# Altium schematic sheet Main.SchDoc: Main sheet
size A4; DrawnBy: Jelle De Vleeschouwer; ProjectName: Wakelet
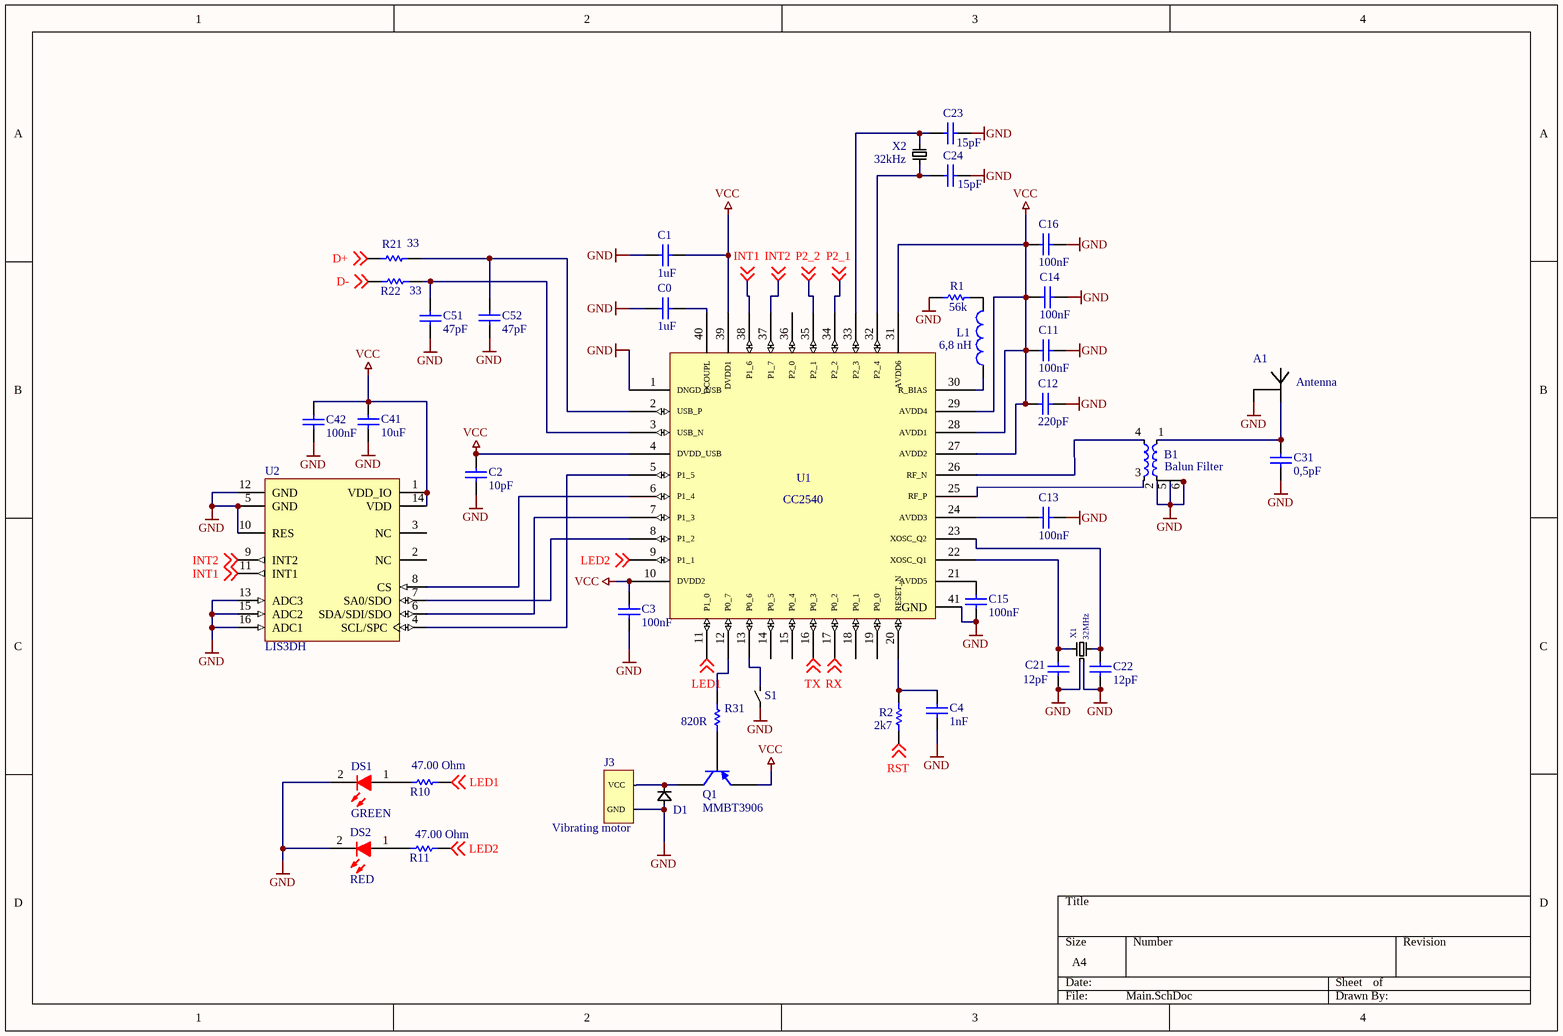
[diagram p0: Main.SchDoc]

## Parts
A1  Antenna  [Antenna]  (net tie, no BOM)
B1  Balun Filter  [Balun Filter]
C0  1uF  [CAPC0402(1005)60_L]
C1  1uF  [CAPC0402(1005)60_L]
C2  10pF  [CAPC0402(1005)60_L]
C3  100nF  [CAPC0402(1005)60_L]
C4  1nF  [CAPC0402(1005)60_L]
C11  100nF  [CAPC0402(1005)60_L]
C12  220pF  [CAPC0402(1005)60_L]
C13  100nF  [CAPC0402(1005)60_L]
C14  100nF  [CAPC0402(1005)60_L]
C15  100nF  [CAPC0402(1005)60_L]
C16  100nF  [CAPC0402(1005)60_L]
C21  12pF  [CAPC0402(1005)60_L]
C22  12pF  [CAPC0402(1005)60_L]
C23  15pF  [CAPC0402(1005)60_L]
C24  15pF  [CAPC0402(1005)60_L]
C31  0,5pF  [CAPC0402(1005)60_L]
C41  10uF  [CAPC0402(1005)60_L]
C42  100nF  [CAPC0402(1005)60_L]
C51  47pF  [CAPC0402(1005)60_L]
C52  47pF  [CAPC0402(1005)60_L]
D1  Diode  [Diode]  (value not drawn)
DS1  GREEN  [TOSH-0603LED_RED_V]
DS2  RED  [TOSH-0603LED_RED_V]
J3  Vibrating motor
L1  6,8 nH  [TAYO-INDC1005-2_V]
Q1  MMBT3906  [SOT-23A_L]
R1  56k  [RESC0402(1005)_N]
R2  2k7  [RESC0402(1005)_M]
R10  47.00 Ohm  [RESC0402(1005)_N]
R11  47.00 Ohm  [RESC0402(1005)_N]
R21  33  [RESC0402(1005)_M]
R22  33  [RESC0402(1005)_M]
R31  820R  [RESC0402(1005)_N]
S1  Switch  [Switch]  (value not drawn)
U1  CC2540  [QFN50P600X600X100_HS-41N_LATEST]
U2  LIS3DH  [STM-LGA-16_N]
X1  32MHz  [XTAL]
X2  32kHz  [XTAL 2]

## Nets
GND: A1.2 B1.2(PINLENGTH=1) B1.5(PINLENGTH=1) B1.6(PINLENGTH=1) C0.2 C1.1 C2.2 C3.2 C4.2 C11.1 C12.1 C13.1 C14.1 C15.2 C16.1 C21.2 C22.2 C23.1 C24.1 C31.2 C41.2 C42.2 C51.2 C52.1 D1.A DS1.2(K) DS2.2(K) J3.1(GND) R1.1 S1.1 U1.1(DNGD_USB) U1.41(GND) U2.5(GND) U2.10(RES) U2.12(GND) U2.13(ADC3) U2.15(ADC2) U2.16(ADC1) X1.2 X1.4
VCC: C1.2 C2.1 C3.1 C11.2 C12.2 C14.2 C16.2 C41.1 C42.1 Q1.2(E) U1.4(DVDD_USB) U1.10(DVDD2) U1.27(AVDD2) U1.28(AVDD1) U1.29(AVDD4) U1.31(AVDD6) U1.39(DVDD1) U2.1(VDD_IO) U2.14(VDD)
D+: R21.1 ; off-sheet D+
D-: R22.1 ; off-sheet D-
INT1: U1.38(P1_6) U2.11(INT1) ; off-sheet INT1
INT2: U1.37(P1_7) U2.9(INT2) ; off-sheet INT2
LED1: R10.2 U1.11(P1_0) ; off-sheet LED1
LED2: R11.2 U1.9(P1_1) ; off-sheet LED2
P2_1: U1.34(P2_2) ; off-sheet P2_1
P2_2: U1.35(P2_1) ; off-sheet P2_2
RST: R2.1 ; off-sheet RST
RX: U1.17(P0_2) ; off-sheet RX
TX: U1.16(P0_3) ; off-sheet TX
NetA1_1: A1.1 B1.1(PINLENGTH=1) C31.1
NetB1_3: B1.3(PINLENGTH=1) U1.25(RF_P)
NetB1_4: B1.4(PINLENGTH=1) U1.26(RF_N)
NetC0_1: C0.1 U1.40(DCOUPL)
NetC4_1: C4.1 R2.2 U1.20(RESET_N)
NetC13_2: C13.2 U1.24(AVDD3)
NetC15_1: C15.1 U1.21(AVDD5)
NetC21_1: C21.1 U1.22(XOSC_Q1) X1.1
NetC22_1: C22.1 U1.23(XOSC_Q2) X1.3
NetC23_2: C23.2 U1.33(P2_3) X2.1
NetC24_2: C24.2 U1.32(P2_4) X2.2
NetC51_1: C51.1 R22.2 U1.3(USB_N)
NetC52_2: C52.2 R21.2 U1.2(USB_P)
NetD1_K: D1.K J3.0(VCC) Q1.3(C)
NetDS1_1: DS1.1(A) R10.1
NetDS2_1: DS2.1(A) R11.1
NetL1_1: L1.1 U1.30(R_BIAS)
NetL1_2: L1.2 R1.2
NetQ1_1: Q1.1(B) R31.2
NetR31_1: R31.1 U1.12(P0_7)
NetS1_2: S1.2 U1.13(P0_6)
NetU1_5: U1.5(P1_5) U2.4(SCL/SPC)
NetU1_6: U1.6(P1_4) U2.8(CS)
NetU1_7: U1.7(P1_3) U2.6(SDA/SDI/SDO)
NetU1_8: U1.8(P1_2) U2.7(SA0/SDO)

Not connected (* = marked no-connect by the designer): U1 14(P0_5) 15(P0_4) 18(P0_1) 19(P0_0) 36(P2_0); U2 2(NC) 3(NC)

## Library data of the parts
B1 = 2450BM15A0002E: BALUN FILTER, 2.45GHZ
C0-C4 C11-C16 C21-C24 C31 C41 C42 C51 C52 = CMP-1034-00698-1: CAP 10pF 10V ±0.25pF 0402 (1005 Metric) Thickness 0.6mm SMD; Case-Metric: 1005; Case-EIA: 0402; Rated Voltage: 10 V; Max Thickness: 0.6 mm; Tolerance: ±0.25pF; Technology: SMT
  C0 C1: Value: 1uF
  C2: Value: 10pF
  C3 C11 C13-C16 C42: Value: 100nF
  C4: Value: 1nF
  C12: Value: 220pF
  C21 C22: Value: 12pF
  C23 C24: Value: 15pF
  C31: Value: 0,5pF
  C41: Value: 10uF
  C51 C52: Value: 47pF
DS1 = CMP-0444-00001-1: LTST-C191KGKT; Manufacturer: Toshiba; PartNumber: TLSU1008A(T04); Forward Current: 25 mA; Power Dissipation: 60 mW; Packing Type: Reel; Reverse Voltage: 4 V; Mounting Technology: Surface Mount; PackageDescription: 2-Pin SMT LED, 1.6 x 0.8 mm Pitch; ComponentLink1URL: http://www.toshiba-components.com/; ComponentLink1Description: Manufacturer URL; PackageReference: 0603LED_RED; ComponentLink2URL: http://www.semicon.toshiba.co.jp/info/docget.jsp?type=datasheet&lang=en&pid=TLSU1008A(T04); ComponentLink2Description: Datasheet; DatasheetVersion: Aug-08; Storage Temperature: -40 to 100 degC
DS2 = CMP-0444-00001-1: LTST-C191KRKT; Manufacturer: Toshiba; PartNumber: TLSU1008A(T04); Forward Current: 25 mA; Power Dissipation: 60 mW; Packing Type: Reel; Reverse Voltage: 4 V; Mounting Technology: Surface Mount; PackageDescription: 2-Pin SMT LED, 1.6 x 0.8 mm Pitch; ComponentLink1URL: http://www.toshiba-components.com/; ComponentLink1Description: Manufacturer URL; PackageReference: 0603LED_RED; ComponentLink2URL: http://www.semicon.toshiba.co.jp/info/docget.jsp?type=datasheet&lang=en&pid=TLSU1008A(T04); ComponentLink2Description: Datasheet; DatasheetVersion: Aug-08; Storage Temperature: -40 to 100 degC
J3 = MISCELLANEOUS CON
L1 = CMP-0436-00001-1: Inductor, Ferrite Bead 1K Ohm@100MHz 300mA 0402; PartNumber: BK1005HS102-T; Manufacturer: Taiyo Yuden; DC Resistance: 0.58 Ohm; Impedance: 1000 Ohm @ 100MHz; PackageDescription: 2-Pin Inductor, 1x0.5mm Body; Mounting Technology: Surface Mount; Rated Current: 300 mA; ComponentLink2URL: http://www.yuden.co.jp/ut/product/category/emisuppression/BK1005HS102-T.pdf; ComponentLink1URL: http://www.yuden.co.jp; DatasheetVersion: Jul-13; ComponentLink1Description: Manufacturer URL; ComponentLink2Description: Datasheet; PackageReference: INDC1005
Q1 = BC807-25: PNP General Purpose Amplifier; Published: 8-Jun-2000; LatestRevisionDate: 20-Nov-2009; LatestRevisionNote: IPC-7351 Footprint Added.; DatasheetVersion: 1997; PackageVersion: Sep-1998; PackageReference: SOT-23A; Publisher: Altium Limited; PackageDescription: 3-Pin SOT-23 Package 0.95 mm Pitch, 2.3 mm Lead Span; ComponentLink1Description: Manufacturer Link; ComponentLink1URL: http://www.fairchildsemi.com/; ComponentLink2Description: Datasheet; ComponentLink2URL: http://www.fairchildsemi.com/ds/BC%2FBC807.pdf
R1 = CMP-1011-00116-1: 56K 0.063W 5% 0402 (1005 Metric)  SMD; Case-EIA: 0402; Case-Metric: 1005; Technology: SMT; Value: 56k; Tolerance: 5 %; Power: 0.063 W
R2 = CMP-1011-00084-1: 2K7 0.063W 5% 0402 (1005 Metric)  SMD; Case-EIA: 0402; Case-Metric: 1005; Value: 2k7; Technology: SMT; Tolerance: 5 %; Power: 0.063 W
R10 R11 = CMP-1011-00042-1: 47R 0.063W 5% 0402 (1005 Metric)  SMD; Case-Metric: 1005; Case-EIA: 0402; Tolerance: 5 %; Power: 0.063 W; Technology: SMT; Value: 47.00 Ohm
R21 R22 = CMP-1011-00038-1: 33R 0.063W 5% 0402 (1005 Metric)  SMD; Case-EIA: 0402; Case-Metric: 1005; Technology: SMT; Tolerance: 5 %; Value: 33; Power: 0.063 W
R31 = CMP-1011-00070-1: 820R 0.063W 5% 0402 (1005 Metric)  SMD; Case-Metric: 1005; Case-EIA: 0402; Power: 0.063 W; Value: 820R; Tolerance: 5 %; Technology: SMT
U1 = CC2540: BLE SoC, 128RHAS, 8051, VQFN-40
U2 = CMP-0234-00056-3: MEMS Digital Output Motion Sensor Ultra Low-Power High Performance 3-Axes "nano" Accelerometer, 1.71 to 3.6 V, -40 to 85 degC, 16-pin (LGA-16), Pb-Free, Tray; Manufacturer: STMicroelectronics; Interface: I2C, SPI; Current Consumption in Power-Down mode: 0.5 uA; Bandwidth: 5 kHz; ComponentLink1URL: http://www.st.com/; Packing: Tray; ComponentLink1Description: Manufacturer URL; Wide Supply Voltage: 1.71 to 3.6 V; ComponentLink3Description: Package Specification; ComponentLink3URL: http://www.st.com/st-web-ui/static/active/en/resource/technical/document/datasheet/CD00274221.pdf; PackageDescription: 16-Pin Land Grid Array, Body 3 x 3 mm, Pitch 0.5 mm; Output Type: Digital; PartNumber: LIS3DH; RoHS: TRUE; DatasheetVersion: Rev. 1; PackageReference: LGA-16; Mounting Technology: Surface Mount; ComponentLink2URL: http://www.st.com/st-web-ui/static/active/en/resource/technical/document/datasheet/CD00274221.pdf; Operating Temperature: -40 to 85 degC; ComponentLink2Description: Datasheet
X1 = XTAL
X2 = XTAL 2